# Altium project Orient2.PrjPcb (part 6 of 6)
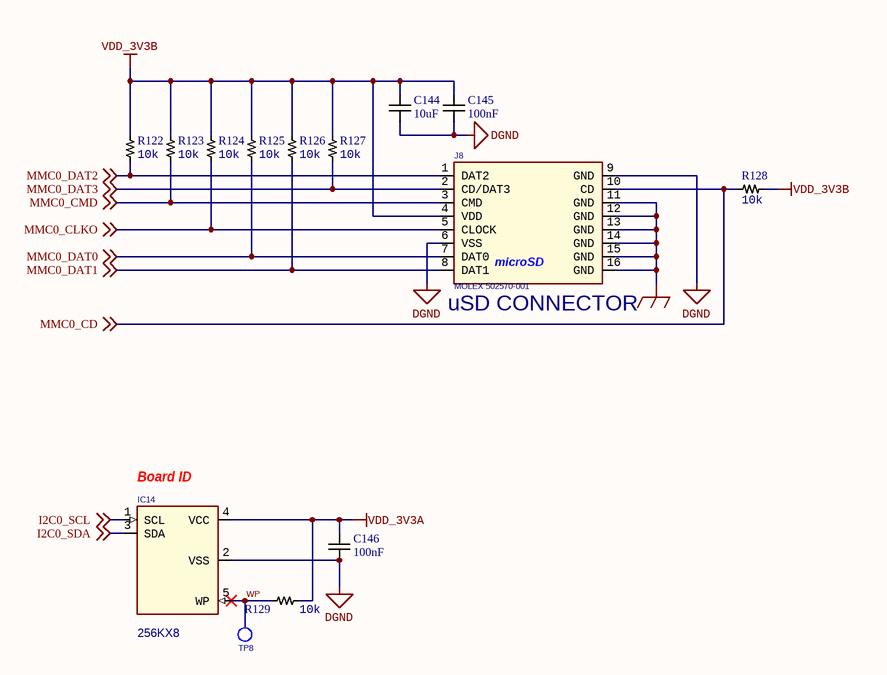
[diagram p10: P10_uSD.SchDoc]

## Nets that join several sheets
DDR_VREF: P02_MPU1_JTAG (C27.1 IC3.J4), P07_DDR3 (6 pins)
DGND: P01_PMIC (32 pins), P02_MPU1_JTAG (16 pins), P03_MPU2_Comm (20 pins), P04_MPU3 (73 pins), P05_MPU4 (38 pins), P06_Boot (18 pins), P07_DDR3 (42 pins), P08_eMMC (19 pins), P09_Ethernet (25 pins), P10_uSD (6 pins)
GND_EARTH: P01_PMIC (M1.1 M2.1 M3.1 M4.1), P03_MPU2_Comm (8 pins), P09_Ethernet (J7.13 J7.14 R92.1), P10_uSD (6 pins)
GNDA_ADC: P03_MPU2_Comm (C29.2 C30.2 C31.2 IC3.A9), P05_MPU4 (C92.2 F9.1 IC3.E8)
SYS_5V: P01_PMIC (14 pins), P03_MPU2_Comm (C28.1 IC5.2 IC5.3), P08_eMMC (C124.1 IC11.2 IC11.3)
USB_DC: P01_PMIC (C2.1 IC1.12), P03_MPU2_Comm (C33.1 IC7.6 J4.1 R30.1)
VDD_1V8: P01_PMIC (C11.2 IC1.40 R5.1), P05_MPU4 (9 pins)
VDD_3V3A: P01_PMIC (5 pins), P02_MPU1_JTAG (C23.2 IC4.5 R18.1), P03_MPU2_Comm (R25.1), P04_MPU3 (39 pins), P05_MPU4 (C94.1 IC3.N15 IC3.R15), P06_Boot (16 pins), P08_eMMC (R75.1), P10_uSD (C146.1 IC14.4 R129.2)
VDD_3V3B: P01_PMIC (C18.1 IC2.3 R11.2), P02_MPU1_JTAG (C26.1 J2.5 R20.2 R21.1), P03_MPU2_Comm (C32.2 IC6.7 IC6.8 R31.2), P08_eMMC (25 pins), P09_Ethernet (7 pins), P10_uSD (10 pins)
VDD_ADC: P03_MPU2_Comm (R27.2), P05_MPU4 (C92.1 F8.1 IC3.D8)
VDD_CORE: P01_PMIC (C9.2 F3.2 IC1.29), P04_MPU3 (20 pins), P05_MPU4 (17 pins)
VDD_MPU: P01_PMIC (C6.2 F2.2 IC1.24), P05_MPU4 (11 pins)
VDDS: P01_PMIC (R5.2 R8.2), P04_MPU3 (13 pins)
VDDS_DDR: P01_PMIC (C5.2 R4.2), P04_MPU3 (16 pins), P07_DDR3 (36 pins)
VRTC: P01_PMIC (C14.2 R7.2), P03_MPU2_Comm (R24.2), P05_MPU4 (C100.1 IC3.D7)
DDR_A0: P02_MPU1_JTAG (IC3.F3), P07_DDR3 (IC10.N3)
DDR_A1: P02_MPU1_JTAG (IC3.H1), P07_DDR3 (IC10.P7)
DDR_A2: P02_MPU1_JTAG (IC3.E4), P07_DDR3 (IC10.P3)
DDR_A3: P02_MPU1_JTAG (IC3.C3), P07_DDR3 (IC10.N2)
DDR_A4: P02_MPU1_JTAG (IC3.C2), P07_DDR3 (IC10.P8)
DDR_A5: P02_MPU1_JTAG (IC3.B1), P07_DDR3 (IC10.P2)
DDR_A6: P02_MPU1_JTAG (IC3.D5), P07_DDR3 (IC10.R8)
DDR_A7: P02_MPU1_JTAG (IC3.E2), P07_DDR3 (IC10.R2)
DDR_A8: P02_MPU1_JTAG (IC3.D4), P07_DDR3 (IC10.T8)
DDR_A9: P02_MPU1_JTAG (IC3.C1), P07_DDR3 (IC10.R3)
DDR_A10: P02_MPU1_JTAG (IC3.F4), P07_DDR3 (IC10.L7)
DDR_A11: P02_MPU1_JTAG (IC3.F2), P07_DDR3 (IC10.R7)
DDR_A12: P02_MPU1_JTAG (IC3.E3), P07_DDR3 (IC10.N7)
DDR_A13: P02_MPU1_JTAG (IC3.H3), P07_DDR3 (IC10.T3)
DDR_A14: P02_MPU1_JTAG (IC3.H4), P07_DDR3 (IC10.T7)
DDR_A15: P02_MPU1_JTAG (IC3.D3), P07_DDR3 (IC10.M7)
DDR_BA0: P02_MPU1_JTAG (IC3.C4), P07_DDR3 (IC10.M2)
DDR_BA1: P02_MPU1_JTAG (IC3.E1), P07_DDR3 (IC10.N8)
DDR_BA2: P02_MPU1_JTAG (IC3.B3), P07_DDR3 (IC10.M3)
DDR_CASn: P02_MPU1_JTAG (IC3.F1), P07_DDR3 (IC10.K3)
DDR_CKE: P02_MPU1_JTAG (IC3.G3), P07_DDR3 (IC10.K9 R70.1)
DDR_CLK: P02_MPU1_JTAG (IC3.D2), P07_DDR3 (IC10.J7)
DDR_CLKn: P02_MPU1_JTAG (IC3.D1), P07_DDR3 (IC10.K7)
DDR_CSn: P02_MPU1_JTAG (IC3.H2), P07_DDR3 (IC10.L2)
DDR_D0: P02_MPU1_JTAG (IC3.M3), P07_DDR3 (IC10.E3)
DDR_D1: P02_MPU1_JTAG (IC3.M4), P07_DDR3 (IC10.F7)
DDR_D2: P02_MPU1_JTAG (IC3.N1), P07_DDR3 (IC10.F2)
DDR_D3: P02_MPU1_JTAG (IC3.N2), P07_DDR3 (IC10.F8)
DDR_D4: P02_MPU1_JTAG (IC3.N3), P07_DDR3 (IC10.H3)
DDR_D5: P02_MPU1_JTAG (IC3.N4), P07_DDR3 (IC10.H8)
DDR_D6: P02_MPU1_JTAG (IC3.P3), P07_DDR3 (IC10.G2)
DDR_D7: P02_MPU1_JTAG (IC3.P4), P07_DDR3 (IC10.H7)
DDR_D8: P02_MPU1_JTAG (IC3.J1), P07_DDR3 (IC10.D7)
DDR_D9: P02_MPU1_JTAG (IC3.K1), P07_DDR3 (IC10.C3)
DDR_D10: P02_MPU1_JTAG (IC3.K2), P07_DDR3 (IC10.C8)
DDR_D11: P02_MPU1_JTAG (IC3.K3), P07_DDR3 (IC10.C2)
DDR_D12: P02_MPU1_JTAG (IC3.K4), P07_DDR3 (IC10.A7)
DDR_D13: P02_MPU1_JTAG (IC3.L3), P07_DDR3 (IC10.A2)
DDR_D14: P02_MPU1_JTAG (IC3.L4), P07_DDR3 (IC10.B8)
DDR_D15: P02_MPU1_JTAG (IC3.M1), P07_DDR3 (IC10.A3)
DDR_DQM0: P02_MPU1_JTAG (IC3.M2), P07_DDR3 (IC10.E7)
DDR_DQM1: P02_MPU1_JTAG (IC3.J2), P07_DDR3 (IC10.D3)
DDR_DQS0: P02_MPU1_JTAG (IC3.P1), P07_DDR3 (IC10.F3)
DDR_DQS1: P02_MPU1_JTAG (IC3.L1), P07_DDR3 (IC10.C7)
DDR_DQSN0: P02_MPU1_JTAG (IC3.P2), P07_DDR3 (IC10.G3)
DDR_DQSN1: P02_MPU1_JTAG (IC3.L2), P07_DDR3 (IC10.B7)
DDR_ODT: P02_MPU1_JTAG (IC3.G1), P07_DDR3 (IC10.K1)
DDR_RASn: P02_MPU1_JTAG (IC3.G4), P07_DDR3 (IC10.J3)
DDR_RESETn: P02_MPU1_JTAG (IC3.G2), P07_DDR3 (IC10.T2 R71.1)
DDR_WEn: P02_MPU1_JTAG (IC3.B2), P07_DDR3 (IC10.L3)
eMMC_RSTn: P02_MPU1_JTAG (R19.2), P08_eMMC (IC12.K5 R87.1)
GPIO3_20: P02_MPU1_JTAG (R16.1), P03_MPU2_Comm (IC3.D13)
I2C0_SCL: P01_PMIC (IC1.28 R2.1), P03_MPU2_Comm (IC3.C16), P10_uSD (IC14.1)
I2C0_SDA: P01_PMIC (IC1.27 R3.1), P03_MPU2_Comm (IC3.C17), P10_uSD (IC14.3)
LDO_PGOOD: P01_PMIC (IC1.46), P02_MPU1_JTAG (IC3.B5)
MDIO_CLK: P03_MPU2_Comm (IC3.M18), P09_Ethernet (IC13.17)
MDIO_DATA: P03_MPU2_Comm (IC3.M17), P09_Ethernet (IC13.16 R97.2)
MII1_COL: P03_MPU2_Comm (IC3.H16), P09_Ethernet (R114.2)
MII1_CRS_DV: P03_MPU2_Comm (IC3.H17), P09_Ethernet (R115.2)
MII1_REFCLK: P03_MPU2_Comm (R28.2), P09_Ethernet (R98.2 R116.2)
MII1_RXCLK: P03_MPU2_Comm (IC3.L18), P09_Ethernet (R104.2)
MII1_RXD0: P03_MPU2_Comm (IC3.M16), P09_Ethernet (R102.2)
MII1_RXD1: P03_MPU2_Comm (IC3.L15), P09_Ethernet (R101.2)
MII1_RXD2: P03_MPU2_Comm (IC3.L16), P09_Ethernet (R100.2)
MII1_RXD3: P03_MPU2_Comm (IC3.L17), P09_Ethernet (R99.2)
MII1_RXDV: P03_MPU2_Comm (IC3.J17), P09_Ethernet (R103.2)
MII1_RXERR: P03_MPU2_Comm (IC3.J15), P09_Ethernet (R105.2)
MII1_TXCLK: P03_MPU2_Comm (IC3.K18), P09_Ethernet (R108.2)
MII1_TXD0: P03_MPU2_Comm (IC3.K17), P09_Ethernet (IC13.22)
MII1_TXD1: P03_MPU2_Comm (IC3.K16), P09_Ethernet (IC13.23)
MII1_TXD2: P03_MPU2_Comm (IC3.K15), P09_Ethernet (IC13.24)
MII1_TXD3: P03_MPU2_Comm (IC3.J18), P09_Ethernet (IC13.25)
MII1_TXEN: P03_MPU2_Comm (IC3.J16), P09_Ethernet (IC13.21)
MMC0_CD: P02_MPU1_JTAG (J2.19), P03_MPU2_Comm (IC3.C15), P10_uSD (J8.10 R128.2)
MMC0_CLKO: P02_MPU1_JTAG (IC3.G17), P10_uSD (J8.5 R124.1)
MMC0_CMD: P02_MPU1_JTAG (IC3.G18), P10_uSD (J8.3 R123.1)
MMC0_DAT0: P02_MPU1_JTAG (IC3.G16), P10_uSD (J8.7 R125.1)
MMC0_DAT1: P02_MPU1_JTAG (IC3.G15), P10_uSD (J8.8 R126.1)
MMC0_DAT2: P02_MPU1_JTAG (IC3.F18), P10_uSD (J8.1 R122.1)
MMC0_DAT3: P02_MPU1_JTAG (IC3.F17), P10_uSD (J8.2 R127.1)
MMC1_CLK: P02_MPU1_JTAG (IC3.U9), P08_eMMC (IC12.M6 R86.1)
MMC1_CMD: P02_MPU1_JTAG (IC3.V9), P08_eMMC (IC12.M5 R85.1)
MMC1_DAT0: P02_MPU1_JTAG (IC3.U7), P08_eMMC (IC12.A3 R77.1)
MMC1_DAT1: P02_MPU1_JTAG (IC3.V7), P08_eMMC (IC12.A4 R78.1)
MMC1_DAT2: P02_MPU1_JTAG (IC3.R8), P08_eMMC (IC12.A5 R79.1)
MMC1_DAT3: P02_MPU1_JTAG (IC3.T8), P08_eMMC (IC12.B2 R80.1)
MMC1_DAT4: P02_MPU1_JTAG (IC3.U8), P08_eMMC (IC12.B3 R81.1)
MMC1_DAT5: P02_MPU1_JTAG (IC3.V8), P08_eMMC (IC12.B4 R82.1)
MMC1_DAT6: P02_MPU1_JTAG (IC3.R9), P08_eMMC (IC12.B5 R83.1)
MMC1_DAT7: P02_MPU1_JTAG (IC3.T9), P08_eMMC (IC12.B6 R84.1)
PMIC_INT: P01_PMIC (IC1.45 R1.1), P02_MPU1_JTAG (IC3.B18)
PMIC_PGOOD: P01_PMIC (IC1.26), P02_MPU1_JTAG (IC3.B15)
PMIC_POWR_EN: P01_PMIC (IC1.9), P03_MPU2_Comm (IC3.C6)
SYS_BOOT0: P03_MPU2_Comm (IC3.R1), P06_Boot (R52.1 R69.2)
SYS_BOOT1: P03_MPU2_Comm (IC3.R2), P06_Boot (R51.1 R68.2)
SYS_BOOT2: P03_MPU2_Comm (IC3.R3), P06_Boot (R50.1 R53.1 R67.2)
SYS_BOOT3: P03_MPU2_Comm (IC3.R4), P06_Boot (R49.1 R66.2)
SYS_BOOT4: P03_MPU2_Comm (IC3.T1), P06_Boot (R48.1 R65.2)
SYS_BOOT5: P03_MPU2_Comm (IC3.T2), P06_Boot (R47.1 R64.2)
SYS_BOOT6: P03_MPU2_Comm (IC3.T3), P06_Boot (R46.1 R63.2)
SYS_BOOT7: P03_MPU2_Comm (IC3.T4), P06_Boot (R45.1 R62.2)
SYS_BOOT8: P03_MPU2_Comm (IC3.U1), P06_Boot (R44.1 R61.2)
SYS_BOOT9: P03_MPU2_Comm (IC3.U2), P06_Boot (R43.1 R60.2)
SYS_BOOT10: P03_MPU2_Comm (IC3.U3), P06_Boot (R42.1 R59.2)
SYS_BOOT11: P03_MPU2_Comm (IC3.U4), P06_Boot (R41.1 R58.2)
SYS_BOOT12: P03_MPU2_Comm (IC3.V2), P06_Boot (R40.1 R57.2)
SYS_BOOT13: P03_MPU2_Comm (IC3.V3), P06_Boot (R39.1 R56.2)
SYS_BOOT14: P03_MPU2_Comm (IC3.V4), P06_Boot (R38.1 R55.2)
SYS_BOOT15: P03_MPU2_Comm (IC3.T5), P06_Boot (R37.1 R54.2)
SYS_RESETn: P02_MPU1_JTAG (7 pins), P09_Ethernet (IC13.19)
USB0_PWR: P03_MPU2_Comm (C34.1 F4.2 F5.1 IC8.6), P08_eMMC (IC11.6 IC11.7 IC11.8)
USB1_OCn: P02_MPU1_JTAG (IC3.T16), P03_MPU2_Comm (IC5.5 R25.2)
WAKEUP: P01_PMIC (IC1.13), P03_MPU2_Comm (IC3.C5 R24.1)

## Assembly variants
Default: not fitted C137 C138 C139 C140 P2 R9 R57 R58 R59 R60 R61 R62 R63 R64 R69 R70 R81 R90 R91 R92 R93 R124 R140 R141